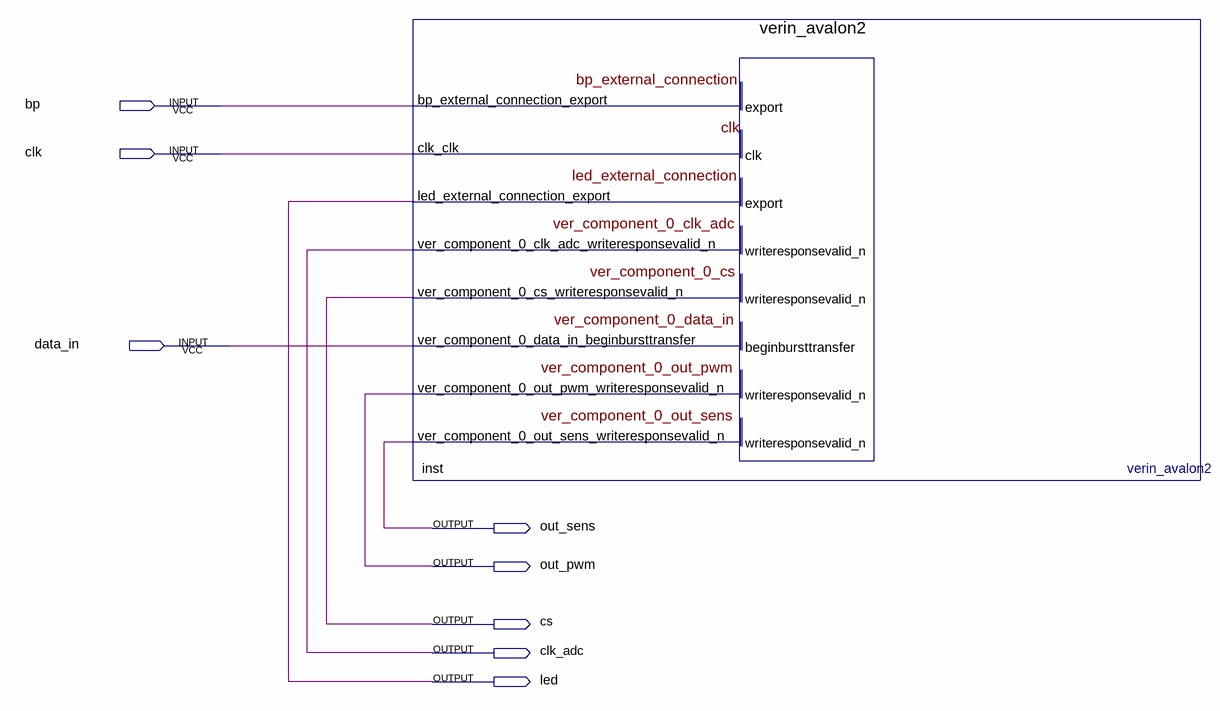
[diagram p0: schematic sheet]
// Quartus schematic avalon_block.bdf as structural Verilog: 1 symbols, 8 pins
module avalon_block (
  input  bp,
  input  clk,
  input  data_in,
  output out_sens,
  output out_pwm,
  output cs,
  output clk_adc,
  output led
);

  verin_avalon2 inst (
    .bp_external_connection_export(bp), .clk_clk(clk), .ver_component_0_data_in_beginbursttransfer(data_in),
    .led_external_connection_export(led), .ver_component_0_clk_adc_writeresponsevalid_n(clk_adc),
    .ver_component_0_cs_writeresponsevalid_n(cs), .ver_component_0_out_pwm_writeresponsevalid_n(out_pwm),
    .ver_component_0_out_sens_writeresponsevalid_n(out_sens));
endmodule
